# EAGLE design MK20_breakout (EAGLE 7.4.0)
OBC with integrated microcontroller
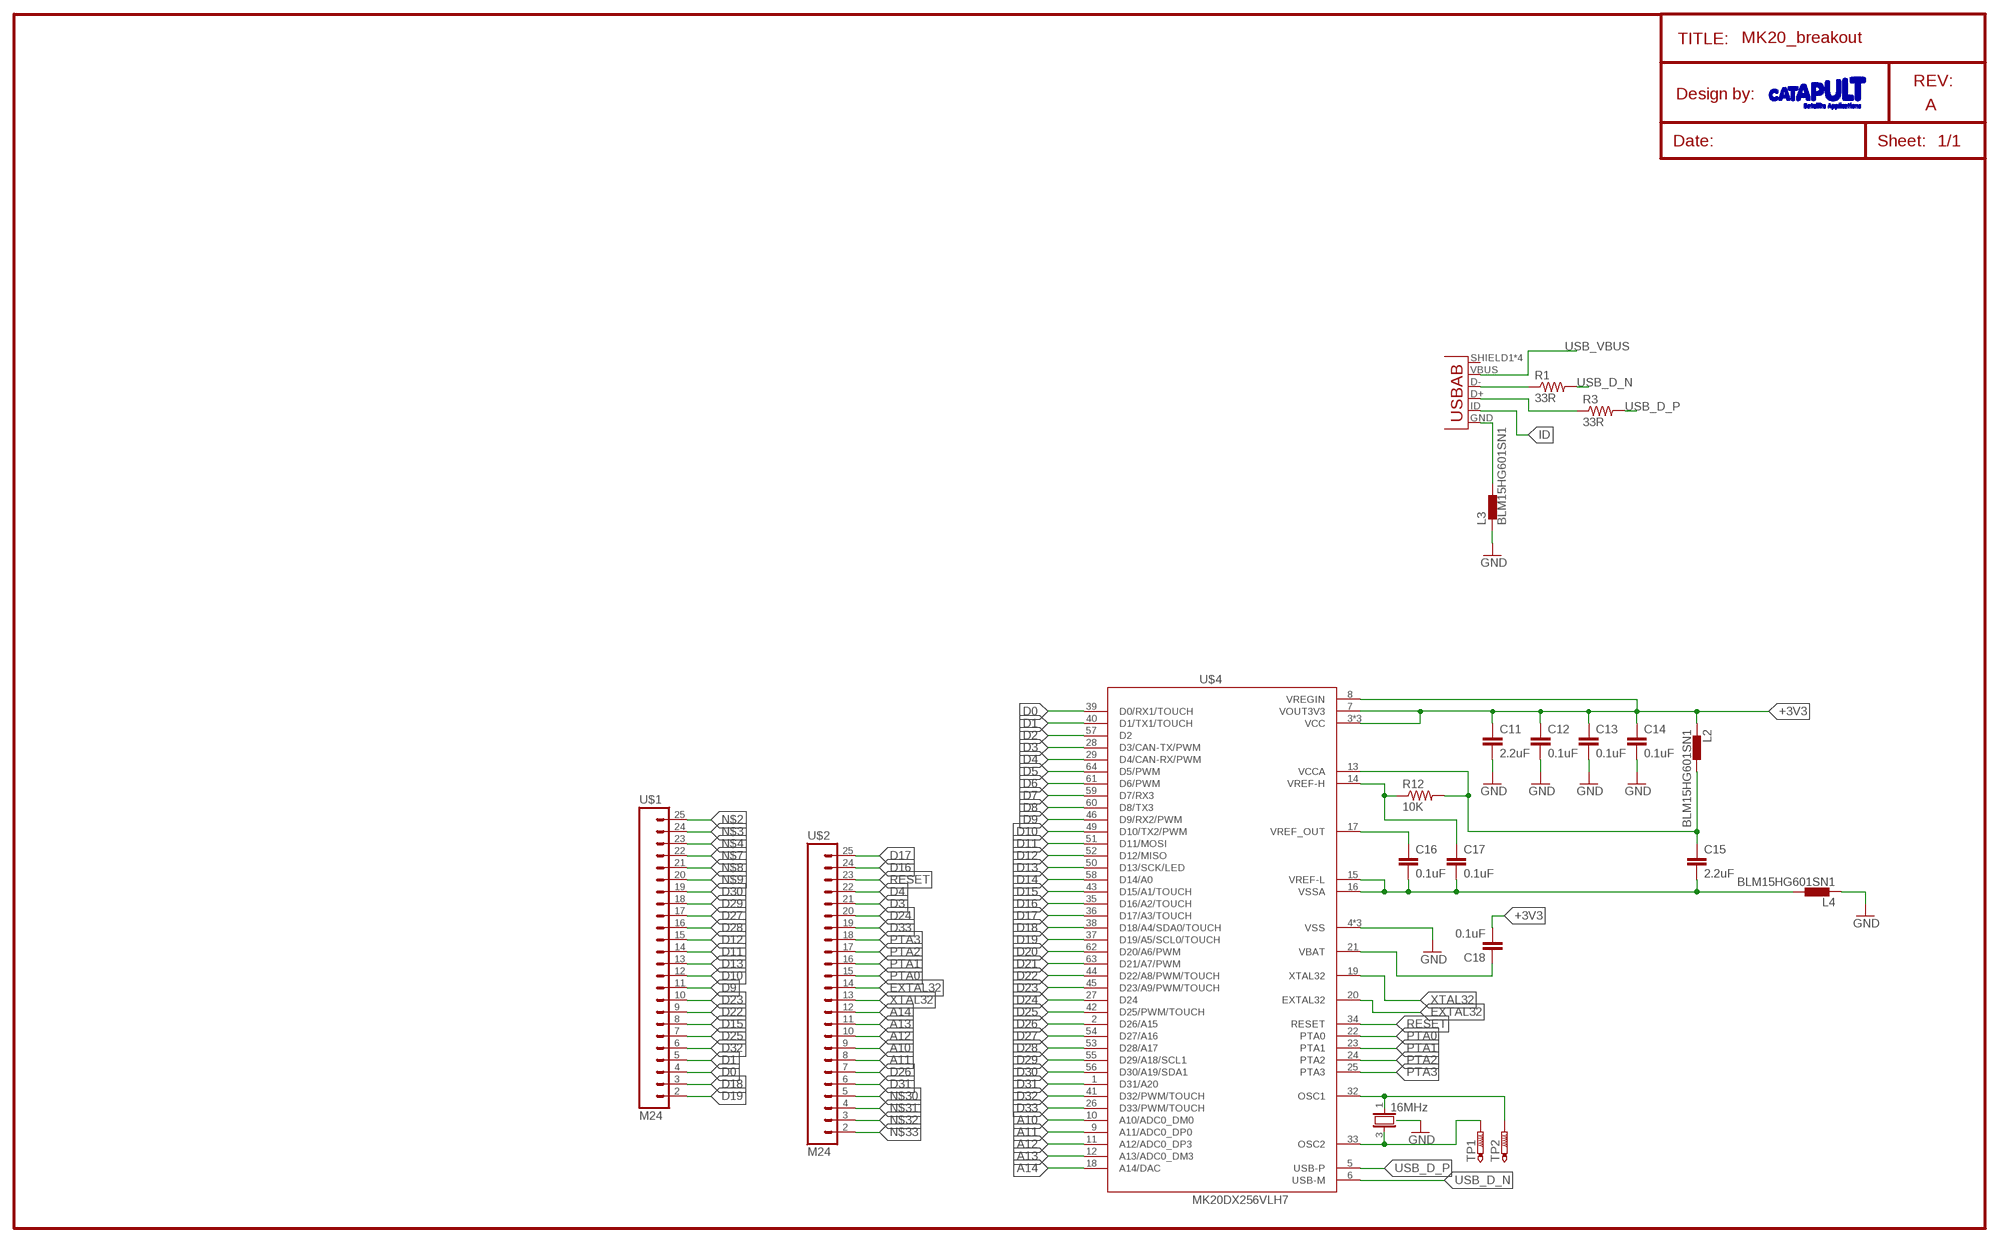
[diagram p0: schematic, sheet 1]

## Parts
C11  2.2uF  C-EUC0603  [C0603]
C12  0.1uF  C-EUC0402  [C0402]
C13  0.1uF  C-EUC0402  [C0402]
C14  0.1uF  C-EUC0402  [C0402]
C15  2.2uF  C-EUC0603  [C0603]
C16  0.1uF  C-EUC0402  [C0402]
C17  0.1uF  C-EUC0402  [C0402]
C18  0.1uF  C-EUC0603  [C0603]
JP1  MOLEX 105017-0001  USB-AB  [USB-AB-MICRO-SMD]
L2  BLM15HG601SN1  [0402]
L3  BLM15HG601SN1  [0402]
L4  BLM15HG601SN1  [0402]
NDK_NX3225SA  16MHz  NDKCRYSTAL  [4SMD_DFN_LCC]
R1  33R  RESISTOR0603-RES  [0603-RES]
R3  33R  RESISTOR0603-RES  [0603-RES]
R12  10K  RESISTOR0402-RES  [0402-RES]
TP1  PTR1TP06R  [TP06R]
TP2  PTR1TP06R  [TP06R]
U$1  M24  [1X24]
U$2  M24  [1X24]
U$4  MK20DX256VLH7  [QFP50P1200X1200X160-64N]

## Nets
+3V3: C11.1 C12.1 C13.1 C14.1 C18.2 L2.1 U$4.3(VCC) U$4.7(VOUT3V3) U$4.8(VREGIN) U$4.30(VCC) U$4.48(VCC)
A10: U$2.9 U$4.10(A10/ADC0_DM0)
A11: U$2.8 U$4.9(A11/ADC0_DP0)
A12: U$2.10 U$4.11(A12/ADC0_DP3)
A13: U$2.11 U$4.12(A13/ADC0_DM3)
A14: U$2.12 U$4.18(A14/DAC)
D0: U$1.4 U$4.39(D0/RX1/TOUCH)
D1: U$1.5 U$4.40(D1/TX1/TOUCH)
D2: U$4.57(D2)
D3: U$2.21 U$4.28(D3/CAN-TX/PWM)
D4: U$2.22 U$4.29(D4/CAN-RX/PWM)
D5: U$4.64(D5/PWM)
D6: U$4.61(D6/PWM)
D7: U$4.59(D7/RX3)
D8: U$4.60(D8/TX3)
D9: U$1.11 U$4.46(D9/RX2/PWM)
D10: U$1.12 U$4.49(D10/TX2/PWM)
D11: U$1.14 U$4.51(D11/MOSI)
D12: U$1.15 U$4.52(D12/MISO)
D13: U$1.13 U$4.50(D13/SCK/LED)
D14: U$4.58(D14/A0)
D15: U$1.8 U$4.43(D15/A1/TOUCH)
D16: U$2.24 U$4.35(D16/A2/TOUCH)
D17: U$2.25 U$4.36(D17/A3/TOUCH)
D18: U$1.3 U$4.38(D18/A4/SDA0/TOUCH)
D19: U$1.2 U$4.37(D19/A5/SCL0/TOUCH)
D20: U$4.62(D20/A6/PWM)
D21: U$4.63(D21/A7/PWM)
D22: U$1.9 U$4.44(D22/A8/PWM/TOUCH)
D23: U$1.10 U$4.45(D23/A9/PWM/TOUCH)
D24: U$2.20 U$4.27(D24)
D25: U$1.7 U$4.42(D25/PWM/TOUCH)
D26: U$2.7 U$4.2(D26/A15)
D27: U$1.17 U$4.54(D27/A16)
D28: U$1.16 U$4.53(D28/A17)
D29: U$1.18 U$4.55(D29/A18/SCL1)
D30: U$1.19 U$4.56(D30/A19/SDA1)
D31: U$2.6 U$4.1(D31/A20)
D32: U$1.6 U$4.41(D32/PWM/TOUCH)
D33: U$2.19 U$4.26(D33/PWM/TOUCH)
EXTAL32: U$2.14 U$4.20(EXTAL32)
GND: C11.2 C12.2 C13.2 C14.2 L3.1 L4.1 NDK_NX3225SA.GND NDK_NX3225SA.GND@1(GND) NDK_NX3225SA.GND@2(GND) U$4.4(VSS) U$4.31(VSS) U$4.47(VSS)
ID: JP1.ID(USBID)
N$1: NDK_NX3225SA.1 TP2.TP U$4.32(OSC1)
N$2: U$1.25
N$3: U$1.24
N$4: U$1.23
N$5: JP1.D+ R3.1
N$6: JP1.D- R1.1
N$7: U$1.22
N$8: U$1.21
N$9: U$1.20
N$23: NDK_NX3225SA.3 TP1.TP U$4.33(OSC2)
N$24: C15.1 L2.2 R12.2 U$4.13(VCCA)
N$25: C17.1 R12.1 U$4.14(VREF-H)
N$26: C15.2 C16.2 C17.2 L4.2 U$4.15(VREF-L) U$4.16(VSSA)
N$27: C16.1 U$4.17(VREF_OUT)
N$28: C18.1 U$4.21(VBAT)
N$30: U$2.5
N$31: U$2.4
N$32: U$2.3
N$33: U$2.2
N$35: JP1.GND L3.2
PTA0: U$2.15 U$4.22(PTA0)
PTA1: U$2.16 U$4.23(PTA1)
PTA2: U$2.17 U$4.24(PTA2)
PTA3: U$2.18 U$4.25(PTA3)
RESET: U$2.23 U$4.34(RESET)
USB_D_N [USB]: R1.2 U$4.6(USB-M)
USB_D_P [USB]: R3.2 U$4.5(USB-P)
USB_VBUS: JP1.VBUS
XTAL32: U$2.13 U$4.19(XTAL32)
Unconnected: JP1.SHIELD1(SHIELD) JP1.SHIELD2(SHIELD) JP1.SHIELD3(SHIELD) JP1.SHIELD4(SHIELD)

## Notes on the sheet
- TITLE:
- REV:
- Design by:
- A
- Date: | Sheet:

## Library data of the parts
C11-C18 = resistor:C-EU: CAPACITOR, European symbol
JP1 = SparkFun-Connectors:USB-AB: This is a USB AB connector that is compatible with USB OTG. i.e. this connector can serve as a host or device
L2-L4 = inductors:BLM15H: EMIFIL (R) Chip Ferrite Bead for GHz Noise Source: http://www.murata.com/ Ferrite Bead BLM15H.pdf
NDK_NX3225SA = OBC:NDKCRYSTAL
R1 R3 R12 = SparkFun-Passives:RESISTOR: Resistor Basic schematic elements and footprints for 0603, 1206, and PTH resistors.
TP1 TP2 = testpad:PTR1: TEST PIN
U$1 U$2 = SparkFun-Connectors:M24: 1x24 .1" header
U$4 = Teensy_3_Series_Chip_v1.2:MK20DX256VLH7: This is a footprint for the MK20dx256VHL7, the chip at the heart of the Teensy 3.1. Notable upgrades over the Teensy 3.0 include more Flash Memory, RAM, a DAC output, additional ADC pins, etc. Remember, if you want to use USB, VOut3v3 has to be attached to the 3.3V bus.

## Net classes
1 USB: width 0.254 mm, clearance 0.159 mm

## Board
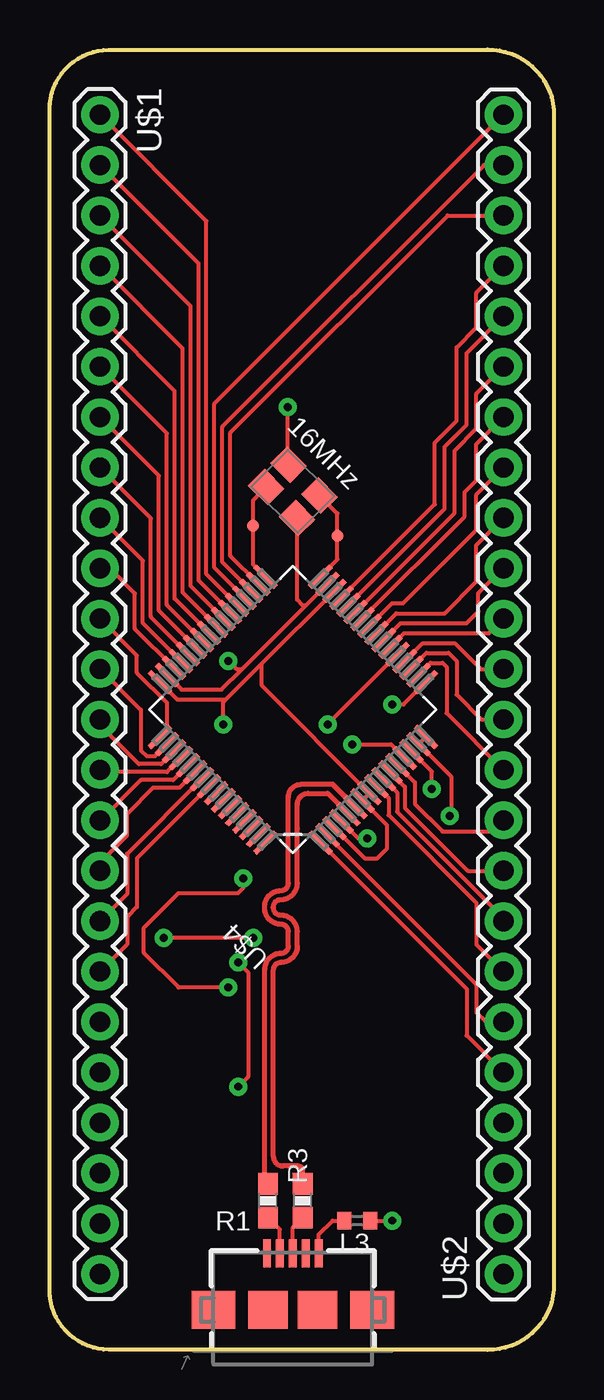
[diagram p1: board, top side]
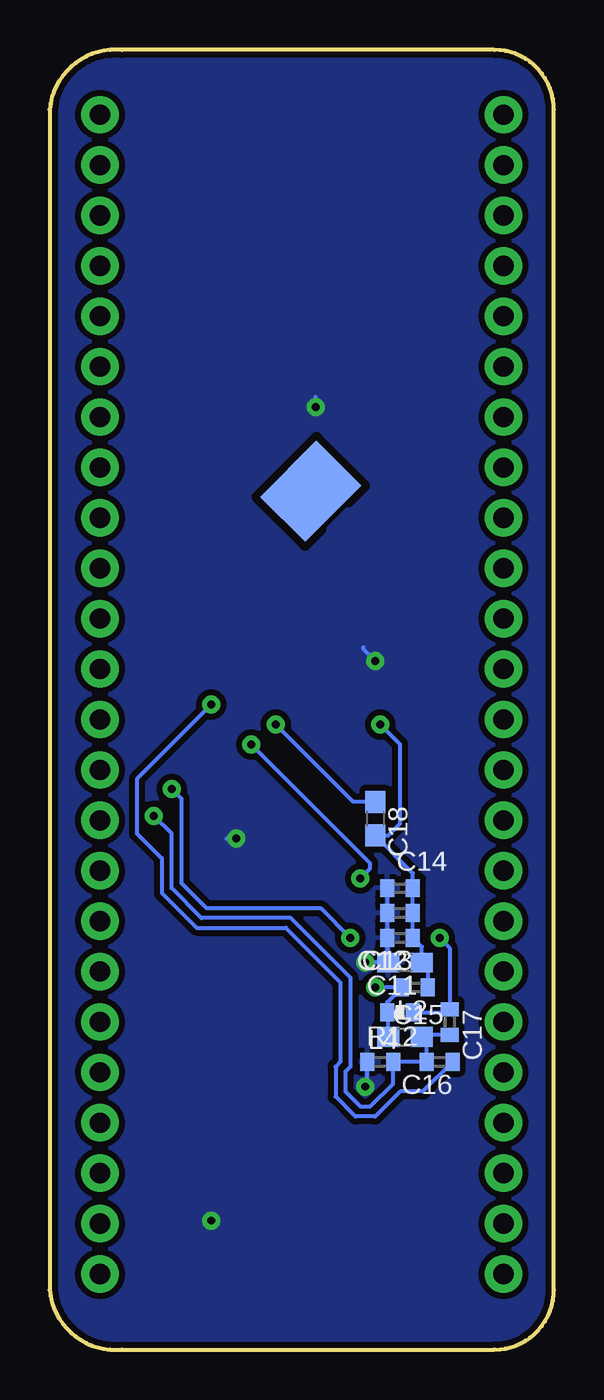
[diagram p2: board, bottom side, seen from below]

Size 25.4 x 65.52 mm. Coordinates in mm from the lower left corner, seen from the top.
Outline: 0,3.02 0,62.51 arc-90 3,65.51 21.75,65.51 arc-90 25.4,62.51 25.4,3.02 arc-90 21.75,0.02 3,0.02 arc-90 0,3.02
Copper layers (1*16): Top 0.035mm / dielectric 1.5mm / Bottom 0.035mm
Design rules "pcbtrain *": minimum track width 0.2mm, minimum drill 0.4mm, track to track 0.2mm, track to pad 0.2mm, pad to pad 0.2mm, via to via 0.2mm, smd to smd 0mil, copper to edge 10mil, drill to drill 0.2mm, minimum pad ring 10mil, minimum via ring 10mil, stop-mask expansion 0.125mm, vias tented up to drill 25mil, thermal gap 10mil

### Footprints (pad centres in the part's own frame; a part is rotated, then mirrored left to right if it is on the bottom)
C0603 = smd 1.1 x 1: 1 -0.85,0; 2 0.85,0
C0402 = smd 0.7 x 0.9: 1 -0.65,0; 2 0.65,0
USB-AB-MICRO-SMD = smd 1.4 x 0.4: D+ 2.85,0; D- 2.85,0.65; GND 2.85,-1.3; ID 2.85,-0.65; VBUS 2.85,1.3 | smd 1.9 x 2.2: SHIELD1 0,4; SHIELD4 0,-4 | smd 1.9 x 2: SHIELD2 0,1.25; SHIELD3 0,-1.25
0402 = smd 0.7 x 0.9: 1 -0.65,0; 2 0.65,0
4SMD_DFN_LCC = smd 1.4 x 1.2: 1 -1.1,-0.8; 3 1.1,0.8; GND@1 1.1,-0.8; GND@2 -1.1,0.8 | smd 4 x 3.2 bottom: GND 0,0
0603-RES = smd 1.1 x 1: 1 -0.85,0; 2 0.85,0
0402-RES = smd 0.7 x 0.9: 1 -0.65,0; 2 0.65,0
TP06R = smd 0.6 x 0.6: TP 0,0
1X24 = drill 1.016 pad 1.88: 2 -26.67,0; 3 -24.13,0; 4 -21.59,0; 5 -19.05,0; 6 -16.51,0; 7 -13.97,0; 8 -11.43,0; 9 -8.89,0; 10 -6.35,0; 11 -3.81,0; 12 -1.27,0; 13 1.27,0; 14 3.81,0; 15 6.35,0; 16 8.89,0; 17 11.43,0; 18 13.97,0; 19 16.51,0; 20 19.05,0; 21 21.59,0; 22 24.13,0; 23 26.67,0; 24 29.21,0; 25 31.75,0
QFP50P1200X1200X160-64N = smd 1.473 x 0.279: 1 -5.715,3.759; 2 -5.715,3.251; 3 -5.715,2.743; 4 -5.715,2.261; 5 -5.715,1.753; 6 -5.715,1.245; 7 -5.715,0.762; 8 -5.715,0.254; 9 -5.715,-0.254; 10 -5.715,-0.762; 11 -5.715,-1.245; 12 -5.715,-1.753; 13 -5.715,-2.261; 14 -5.715,-2.743; 15 -5.715,-3.251; 16 -5.715,-3.759; 33 5.715,-3.759; 34 5.715,-3.251; 35 5.715,-2.743; 36 5.715,-2.261; 37 5.715,-1.753; 38 5.715,-1.245; 39 5.715,-0.762; 40 5.715,-0.254; 41 5.715,0.254; 42 5.715,0.762; 43 5.715,1.245; 44 5.715,1.753; 45 5.715,2.261; 46 5.715,2.743; 47 5.715,3.251; 48 5.715,3.759 | smd 0.279 x 1.473: 17 -3.759,-5.715; 18 -3.251,-5.715; 19 -2.743,-5.715; 20 -2.261,-5.715; 21 -1.753,-5.715; 22 -1.245,-5.715; 23 -0.762,-5.715; 24 -0.254,-5.715; 25 0.254,-5.715; 26 0.762,-5.715; 27 1.245,-5.715; 28 1.753,-5.715; 29 2.261,-5.715; 30 2.743,-5.715; 31 3.251,-5.715; 32 3.759,-5.715; 49 3.759,5.715; 50 3.251,5.715; 51 2.743,5.715; 52 2.261,5.715; 53 1.753,5.715; 54 1.245,5.715; 55 0.762,5.715; 56 0.254,5.715; 57 -0.254,5.715; 58 -0.762,5.715; 59 -1.245,5.715; 60 -1.753,5.715; 61 -2.261,5.715; 62 -2.743,5.715; 63 -3.251,5.715; 64 -3.759,5.715

### Placement (x,y rotation side)
C11  7.5,19.52 180 bottom
C12  7.75,22.02 180 bottom
C13  7.75,20.77 180 bottom
C14  7.75,23.27 180 bottom
C15  7.5,15.77 0 bottom
C16  5.75,14.52 180 bottom
C17  5.25,16.52 270 bottom
C18  9,26.77 270 bottom
JP1  12.25,2.02 90 top
L2  7,18.27 180 bottom
L3  15.5,6.52 180 top
L4  8.75,14.52 0 bottom
NDK_NX3225SA  12.25,43.27 135 top
R1  11,7.52 90 top
R3  12.75,7.52 90 top
R12  7.75,17.02 180 bottom
TP1  10.25,41.52 0 top
TP2  14.5,41.02 0 top
U$1  2.54,35.58 270 top
U$2  22.86,30.5 90 top
U$4  12.25,32.27 135 top

### Tracks (layer width: path | path; a pad name or v marks a point on that pad's centre or on a via)
+3V3  (via drill 0.4)
  Top 0.2: U$4.48 6.43,32.77 8.87,32.77 | 8.87,32.77 10.69,34.58 | 10.69,34.58 U$4.30 | v8.75,31.52 8.75,32.64 8.87,32.77 | U$4.3 15.87,24.77 16.5,24.77 17,25.27 17,26.44 U$4.7 | 10.69,34.58 10.69,33.47 U$4.8 U$4.7 | U$4.7
  Bottom 0.2: C18.2 8.65,25.92 | C18.2 7.1,24.02 C14.1 C12.1 C13.1 6.65,20.32 C11.1 6.35,19.22 L2.1 | C18.2 8.35,25.92 7.75,26.52 7.75,30.52 v8.75,31.52
A10
  Top 0.2: U$4.10 17.5,28.09 17.5,27.12 22.86,21.76 U$2.9
A11
  Top 0.2: U$4.9 17.07,27.8 17.07,26.95 21.5,22.52 21.5,20.43 U$2.8
A12
  Top 0.2: U$4.11 17.9,28.38 17.9,27.32 21.07,24.15 U$2.10
A13
  Top 0.2: U$4.12 18.4,28.59 18.4,27.52 19.8,26.12 22.29,26.12 U$2.11
A14
  Top 0.2: U$4.18 19.2,34.62 19.8,34.62 20,34.42 20,32.09 U$2.12
D0
  Top 0.2: U$4.39 7.1,38.49 7.1,52.61 U$1.4
D1
  Top 0.2: U$4.40 6.7,38.17 6.7,50.47 U$1.5
D3
  Top 0.2: U$4.28 19.9,42.39 19.9,45.52 21,46.62 21,50.23 U$2.21
D4
  Top 0.2: U$4.29 19.4,42.61 19.4,45.72 20.5,46.82 20.5,50.52 21.5,51.52 21.5,53.27 U$2.22
D9
  Top 0.2: U$4.46 4.3,36.34 4.3,38.12 3.03,39.39 U$1.11
D10
  Top 0.2: U$1.12 4.4,34.99 4.4,34.12 5.9,32.62 5.9,31.23 U$4.49
D11
  Top 0.2: 2.54,31.68 U$1.14 2.54,31.48 4.5,29.52 5.62,29.52 U$4.51
D12
  Top 0.2: U$4.52 5.9,29.12 2.65,29.12 U$1.15
D13
  Top 0.2: U$1.13 4.6,32.25 4.6,30.22 4.9,29.92 5.3,29.92 U$4.50
D15
  Top 0.2: U$4.43 5.5,37.26 5.5,44.05 U$1.8
D16
  Top 0.2: U$4.35 8.7,39.69 8.7,46.52 21.89,59.71 U$2.24
D17
  Top 0.2: U$4.36 8.3,39.41 8.3,47.69 U$2.25
D18
  Top 0.2: U$4.38 7.5,38.78 7.5,54.75 U$1.3
D19
  Top 0.2: U$4.37 7.9,39.09 7.9,56.89 U$1.2
D22
  Top 0.2: U$4.44 5.1,36.94 5.1,41.91 U$1.9
D23
  Top 0.2: U$4.45 4.7,36.62 4.7,39.77 U$1.10
D24
  Top 0.2: U$4.27 20.4,42.18 20.4,45.32 21.5,46.42 21.5,48.19 U$2.20
D25
  Top 0.2: U$4.42 5.9,37.54 5.9,46.19 U$1.7
D26
  Top 0.2: U$4.2 21.5,18.42 21.5,17.02 21.99,16.53 U$2.7
D27
  Top 0.2: U$4.54 6.54,28.32 5.2,28.32 3.9,27.02 3.9,25.92 2.54,24.56 U$1.17
D28
  Top 0.2: U$4.53 6.22,28.72 4.6,28.72 2.57,26.69 U$1.16
D29
  Top 0.2: U$4.55 3.9,24.99 3.9,22.97 U$1.18
D30
  Top 0.2: U$4.56 4.4,24.77 4.4,22.32 3.9,21.82 3.9,20.43 U$1.19
D31
  Top 0.2: U$4.1 21,18.2 21,15.85 U$2.6
D32
  Top 0.2: U$4.41 6.3,37.86 6.3,48.33 U$1.6
D33
  Top 0.2: U$4.26 20.9,41.99 20.9,43.22 21.5,43.82 21.5,45.65 U$2.19
EXTAL32
  Top 0.2: U$4.20 18.8,35.62 20.4,35.62 21.71,34.31 U$2.14
GND  (via drill 0.4)
  Top 0.2: NDK_NX3225SA.GND@2 12.46,37.8 12.75,37.52 12.9,37.52 | U$4.31 12.9,37.52 | U$4.47 6.65,33.27 8.65,33.27 9.7,34.31 | 9.7,34.31 12.9,37.52 | L3.1 v17.25,6.52 | NDK_NX3225SA.GND@1 12,44.65 v12,47.52 | U$4.4 15.55,25.77 v16,25.77 | v9.5,19.52 10,19.02 10,13.77 v9.5,13.27 | v9,34.72 9.4,34.31 9.7,34.31
  Bottom 0.2: v12,47.52 12,48.02 | C14.2 C12.2 C13.2 8.4,19.57 C11.2 v9.5,19.52 | v16,25.77 16.5,25.77 | v9.5,13.27 9.4,13.37 L4.1 | v9,34.72 9.6,35.32 9.6,35.42
  pour Bottom (isolate 0.3): 0,0.02 0,65.51 25.4,65.51 25.4,0.02
N$1
  Top 0.2: U$4.32 14.5,39.83 TP2.TP 14.5,42.15 NDK_NX3225SA.1
N$5
  Top 0.2: JP1.D+ 12.25,6.17 R3.1
N$6
  Top 0.2: JP1.D- 11.6,6.07 R1.1
N$23
  Top 0.2: U$4.33 10.25,39.58 TP1.TP 10.25,42.82 NDK_NX3225SA.3
N$24  (via drill 0.4)
  Top 0.2: v15.25,30.52 17.2,30.52 U$4.13 | v9,18.27 6.5,18.27 4.75,20.02 4.75,21.27 6.5,23.02 9.5,23.02 9.75,23.27 v9.75,23.77
  Bottom 0.2: C15.1 8.35,16.97 R12.2 8.4,17.52 L2.2 v9,18.27 | v15.25,30.52 9.25,24.52 9.25,24.27 v9.75,23.77
N$25  (via drill 0.4)
  Top 0.2: v19.25,28.27 19.25,29.14 U$4.14 | v10.25,20.77 v5.75,20.77
  Bottom 0.2: v19.25,28.27 18.75,27.77 18.75,23.52 17.5,22.27 11.75,22.27 v10.25,20.77 | R12.1 5.4,17.02 C17.1 5.25,20.27 v5.75,20.77
N$26  (via drill 0.4)
  Top 0.2: v20.15,26.92 20.25,27.02 20.25,28.86 U$4.15 U$4.16
  Bottom 0.2: v20.15,26.92 19.25,26.02 19.25,23.27 17.75,21.77 13.25,21.77 10.25,18.77 10.25,14.27 10.5,14.02 10.5,13.02 9.75,12.27 9.25,12.27 8.1,13.42 L4.2 C16.2 6.4,15.52 C15.2 6.55,15.87 C17.2
N$27  (via drill 0.4)
  Top 0.2: U$4.17 17.82,32.52 v17.25,32.52
  Bottom 0.2: v17.25,32.52 21,28.77 21,26.02 19.75,24.77 19.75,23.02 18,21.27 13.5,21.27 10.75,18.52 10.75,14.52 11,14.27 11,12.77 10,11.77 9,11.77 7.75,13.02 6.6,13.02 C16.1
N$28  (via drill 0.4)
  Top 0.2: U$4.21 14,31.54 v14,31.52
  Bottom 0.2: C18.1 10.1,27.62 v14,31.52
N$35
  Top 0.2: JP1.GND 13.55,5.82 14.25,6.52 L3.2
PTA0
  Top 0.2: U$4.22 17.86,36.12 22.13,36.12 U$2.15
PTA1
  Top 0.2: U$4.23 17.68,36.62 21,36.62 21.6,37.22 21.6,38.13 U$2.16
PTA2
  Top 0.2: U$4.24 17.46,37.12 19.9,37.12 21.5,38.72 21.5,40.57 U$2.17
PTA3
  Top 0.2: U$4.25 17.24,37.62 17.8,37.62 21.5,41.32 21.5,43.11 U$2.18
RESET
  Top 0.2: U$4.34 9.1,40.01 9.1,46.22 20.05,57.17 U$2.23
USB_D_N
  Top 0.25: U$4.6 14.26,28.49 12.66,28.49 arc90 12.03,27.86 12.03,23.52 arc-90 11.65,23.14 arc90 10.82,22.32 10.82,22.27 arc90 11.65,21.45 arc-90 12.03,21.07 12.03,20.35 arc-90 11.65,19.97 arc90 10.82,19.15 10.82,8.54 R1.2
USB_D_P
  Top 0.25: U$4.5 14,28.04 13.02,28.04 arc90 12.47,27.49 12.47,26.27 12.47,23.52 arc-90 11.65,22.69 arc90 11.28,22.32 11.28,22.27 arc90 11.65,21.9 arc-90 12.47,21.07 12.47,20.35 arc-90 11.65,19.52 arc90 11.28,19.15 11.28,9.74 arc90 11.75,9.27 12.5,9.27 arc-90 12.75,9.02 R3.2
XTAL32
  Top 0.2: U$4.19 18.98,35.12 20.1,35.12 20.5,34.72 20.5,33.02 21.75,31.77 U$2.13